# Altium schematic sheet [7] Motor_Control.SchDoc
size A4; Organization: UNMEI ELECTRICAL; Address1: 16B/12 Nguyen Du Street; Address2: Da Lat City, LD Province; SheetNumber: 7; SheetTotal: 7
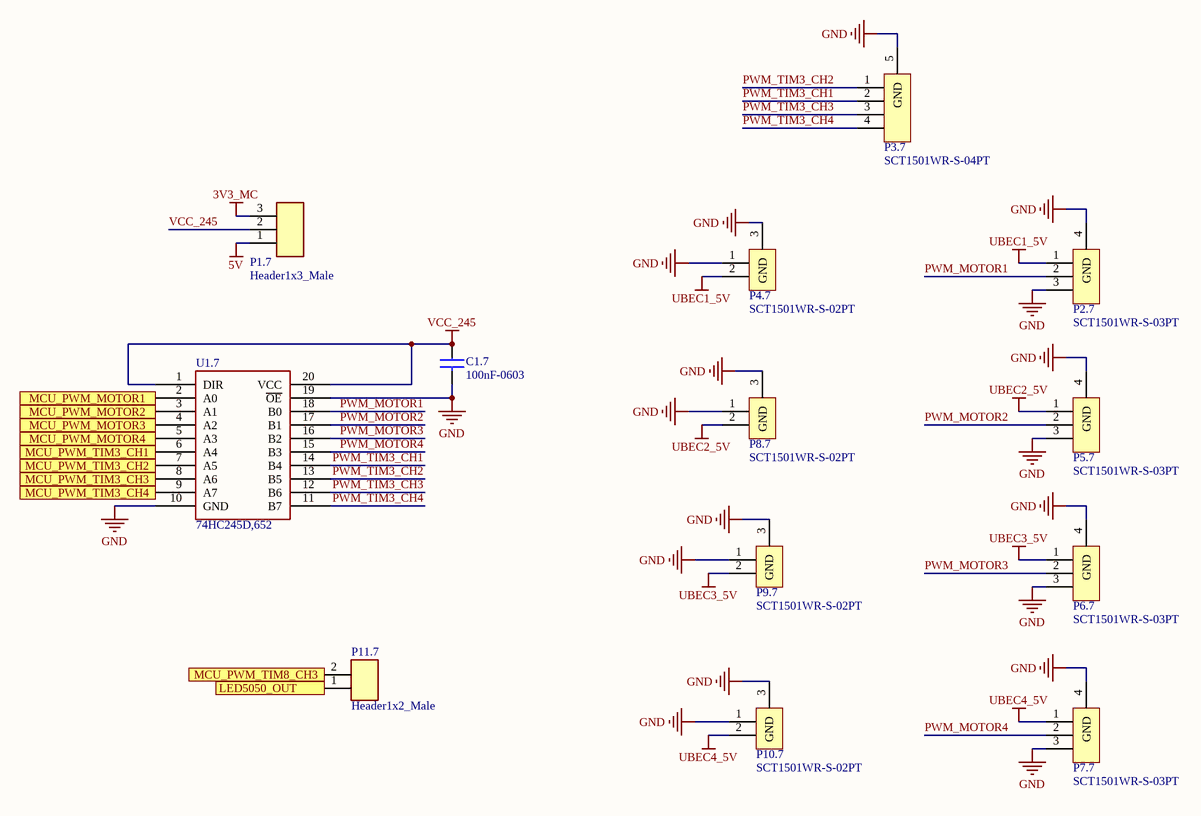
[diagram p0: [7] Motor_Control.SchDoc]

## Parts
C1.7  100nF-0603  [CAP0603]
P1.7  Header1x3_Male  [HDR1x3_2.54_MALE]
P2.7  SCT1501WR-S-03PT  [Connector ZH1.5 3P SMD]
P3.7  SCT1501WR-S-04PT  [Connector ZH1.5 4P SMD]
P4.7  SCT1501WR-S-02PT  [Connector ZH1.5 2P SMD]
P5.7  SCT1501WR-S-03PT  [Connector ZH1.5 3P SMD]
P6.7  SCT1501WR-S-03PT  [Connector ZH1.5 3P SMD]
P7.7  SCT1501WR-S-03PT  [Connector ZH1.5 3P SMD]
P8.7  SCT1501WR-S-02PT  [Connector ZH1.5 2P SMD]
P9.7  SCT1501WR-S-02PT  [Connector ZH1.5 2P SMD]
P10.7  SCT1501WR-S-02PT  [Connector ZH1.5 2P SMD]
P11.7  Header1x2_Male  [HDR1x2_2.54_MALE]
U1.7  74HC245D,652  [SOT163-1_NEX]

## Ports
LED5050_OUT, MCU_PWM_MOTOR1, MCU_PWM_MOTOR2, MCU_PWM_MOTOR3, MCU_PWM_MOTOR4, MCU_PWM_TIM3_CH1, MCU_PWM_TIM3_CH2, MCU_PWM_TIM3_CH3, MCU_PWM_TIM3_CH4, MCU_PWM_TIM8_CH3

## Nets
3V3_MC: P1.7.3
5V: P1.7.1
GND: C1.7.2 P2.7.3 P2.7.4(GND) P3.7.5(GND) P4.7.1 P4.7.3(GND) P5.7.3 P5.7.4(GND) P6.7.3 P6.7.4(GND) P7.7.3 P7.7.4(GND) P8.7.1 P8.7.3(GND) P9.7.1 P9.7.3(GND) P10.7.1 P10.7.3(GND) U1.7.10(GND) U1.7.19(~{OE})
UBEC1_5V: P2.7.1 P4.7.2
UBEC2_5V: P5.7.1 P8.7.2
UBEC3_5V: P6.7.1 P9.7.2
UBEC4_5V: P7.7.1 P10.7.2
VCC_245: C1.7.1 P1.7.2 U1.7.1(DIR) U1.7.20(VCC)
LED5050_OUT: P11.7.1 ; port LED5050_OUT
MCU_PWM_MOTOR1: U1.7.2(A0) ; port MCU_PWM_MOTOR1
MCU_PWM_MOTOR2: U1.7.3(A1) ; port MCU_PWM_MOTOR2
MCU_PWM_MOTOR3: U1.7.4(A2) ; port MCU_PWM_MOTOR3
MCU_PWM_MOTOR4: U1.7.5(A3) ; port MCU_PWM_MOTOR4
MCU_PWM_TIM3_CH1: U1.7.6(A4) ; port MCU_PWM_TIM3_CH1
MCU_PWM_TIM3_CH2: U1.7.7(A5) ; port MCU_PWM_TIM3_CH2
MCU_PWM_TIM3_CH3: U1.7.8(A6) ; port MCU_PWM_TIM3_CH3
MCU_PWM_TIM3_CH4: U1.7.9(A7) ; port MCU_PWM_TIM3_CH4
MCU_PWM_TIM8_CH3: P11.7.2 ; port MCU_PWM_TIM8_CH3
PWM_MOTOR1: P2.7.2 U1.7.18(B0)
PWM_MOTOR2: P5.7.2 U1.7.17(B1)
PWM_MOTOR3: P6.7.2 U1.7.16(B2)
PWM_MOTOR4: P7.7.2 U1.7.15(B3)
PWM_TIM3_CH1: P3.7.2 U1.7.14(B4)
PWM_TIM3_CH2: P3.7.1 U1.7.13(B5)
PWM_TIM3_CH3: P3.7.3 U1.7.12(B6)
PWM_TIM3_CH4: P3.7.4 U1.7.11(B7)

## Notes on the sheet
- Title
- Size:
- Date:
- Author:
- A4
- Time:
- Number:
- Checked:
- Revision:
- Sheet
- Approved:
- of
- https://unmeiongaku.moe/
- +84 337624412
- File:

## Library data of the parts
C1.7 = CC0603KRX7R9BB104: CAP CER 0.1UF 50V X7R 0603; Manufacturer 1: Yageo; Category 1: Capacitors; Capacitance: 0.1µF; Tolerance: ±10%; Value: 100nF; Supplier 1: Digi-Key; Supplier Part Number 1: 311-1344-1-ND; Manufacturer Part Number 1: CC0603KRX7R9BB104; RoHS 1: RoHS Compliant; Description 1: CAP CER 0.1UF 50V X7R 0603; Stock 1: 4411645; Pricing 1: 1=0.1, 10=0.031, 100=0.014, 500=0.00998, 1000=0.00783 (USD); Packaging: Cut Tape (CT); Part Status: Active; Voltage - Rated: 50V; Temperature Coefficient: X7R; Operating Temperature: -55°C ~ 125°C; Features: -; Ratings: -; Applications: General Purpose; Failure Rate: -; Mounting Type: Surface Mount, MLCC; Package / Case: 0603 (1608 Metric); Size / Dimension: 0.063" L x 0.031" W (1.60mm x 0.80mm); Height - Seated (Max): -; Thickness (Max): 0.035" (0.90mm); Lead Spacing: -; Lead Style: -; ComponentLink1URL: http://www.yageo.com/documents/recent/UPY-GPHC_X7R_6.3V-to-50V_18.pdf; ComponentLink1Description: http://www.yageo.com/documents/recent/UPY-GPHC_X7R_6.3V-to-50V_18.pdf
P1.7 = HDR1x3_2.54_MALE: Header1x3_2.54_MALE
P11.7 = HDR1x2_2.54_MALE: Header1x2_2.54_MALE
U1.7 = 74HC245D,652: Vendor: Nexperia; SourceLibrary: Nexperia_2018-05-2018; Manufacturer_Part_Number: 74HC245D,652; Copyright: Copyright (C) 2016 Accelerated Designs. All rights reserved; RefDes: RefDes; Type: DEV; Local Supplier: thegioiic; Local Supplier Part number: *; Local Supplier Link: https://www.thegioiic.com/products/74hc245d